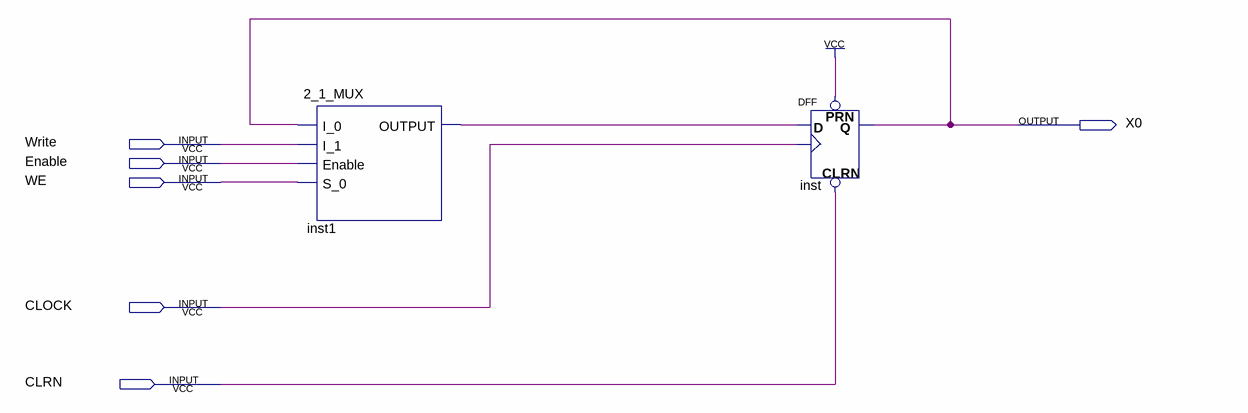
[diagram p0: schematic sheet]
// Quartus schematic 1_BIT_REGISTER.bdf as structural Verilog: 2 symbols, 6 pins
module \1_BIT_REGISTER  (
  input  Write,
  input  Enable,
  input  WE,
  input  CLOCK,
  input  CLRN,
  output X0
);

  wire inst1_output;

  \2_1_MUX  inst1 (.I_0(X0), .I_1(Write), .Enable(Enable), .S_0(WE), .OUTPUT(inst1_output));
  DFF inst (.CLRN(CLRN), .CLK(CLOCK), .D(inst1_output), .PRN(1'b1), .Q(X0));
endmodule
